# EAGLE design AtmegaSwitch (EAGLE 7.2.0)
CNAME: Final Year Project; CREVISION: 1.1; DESIGNER: Adil Benabdallah
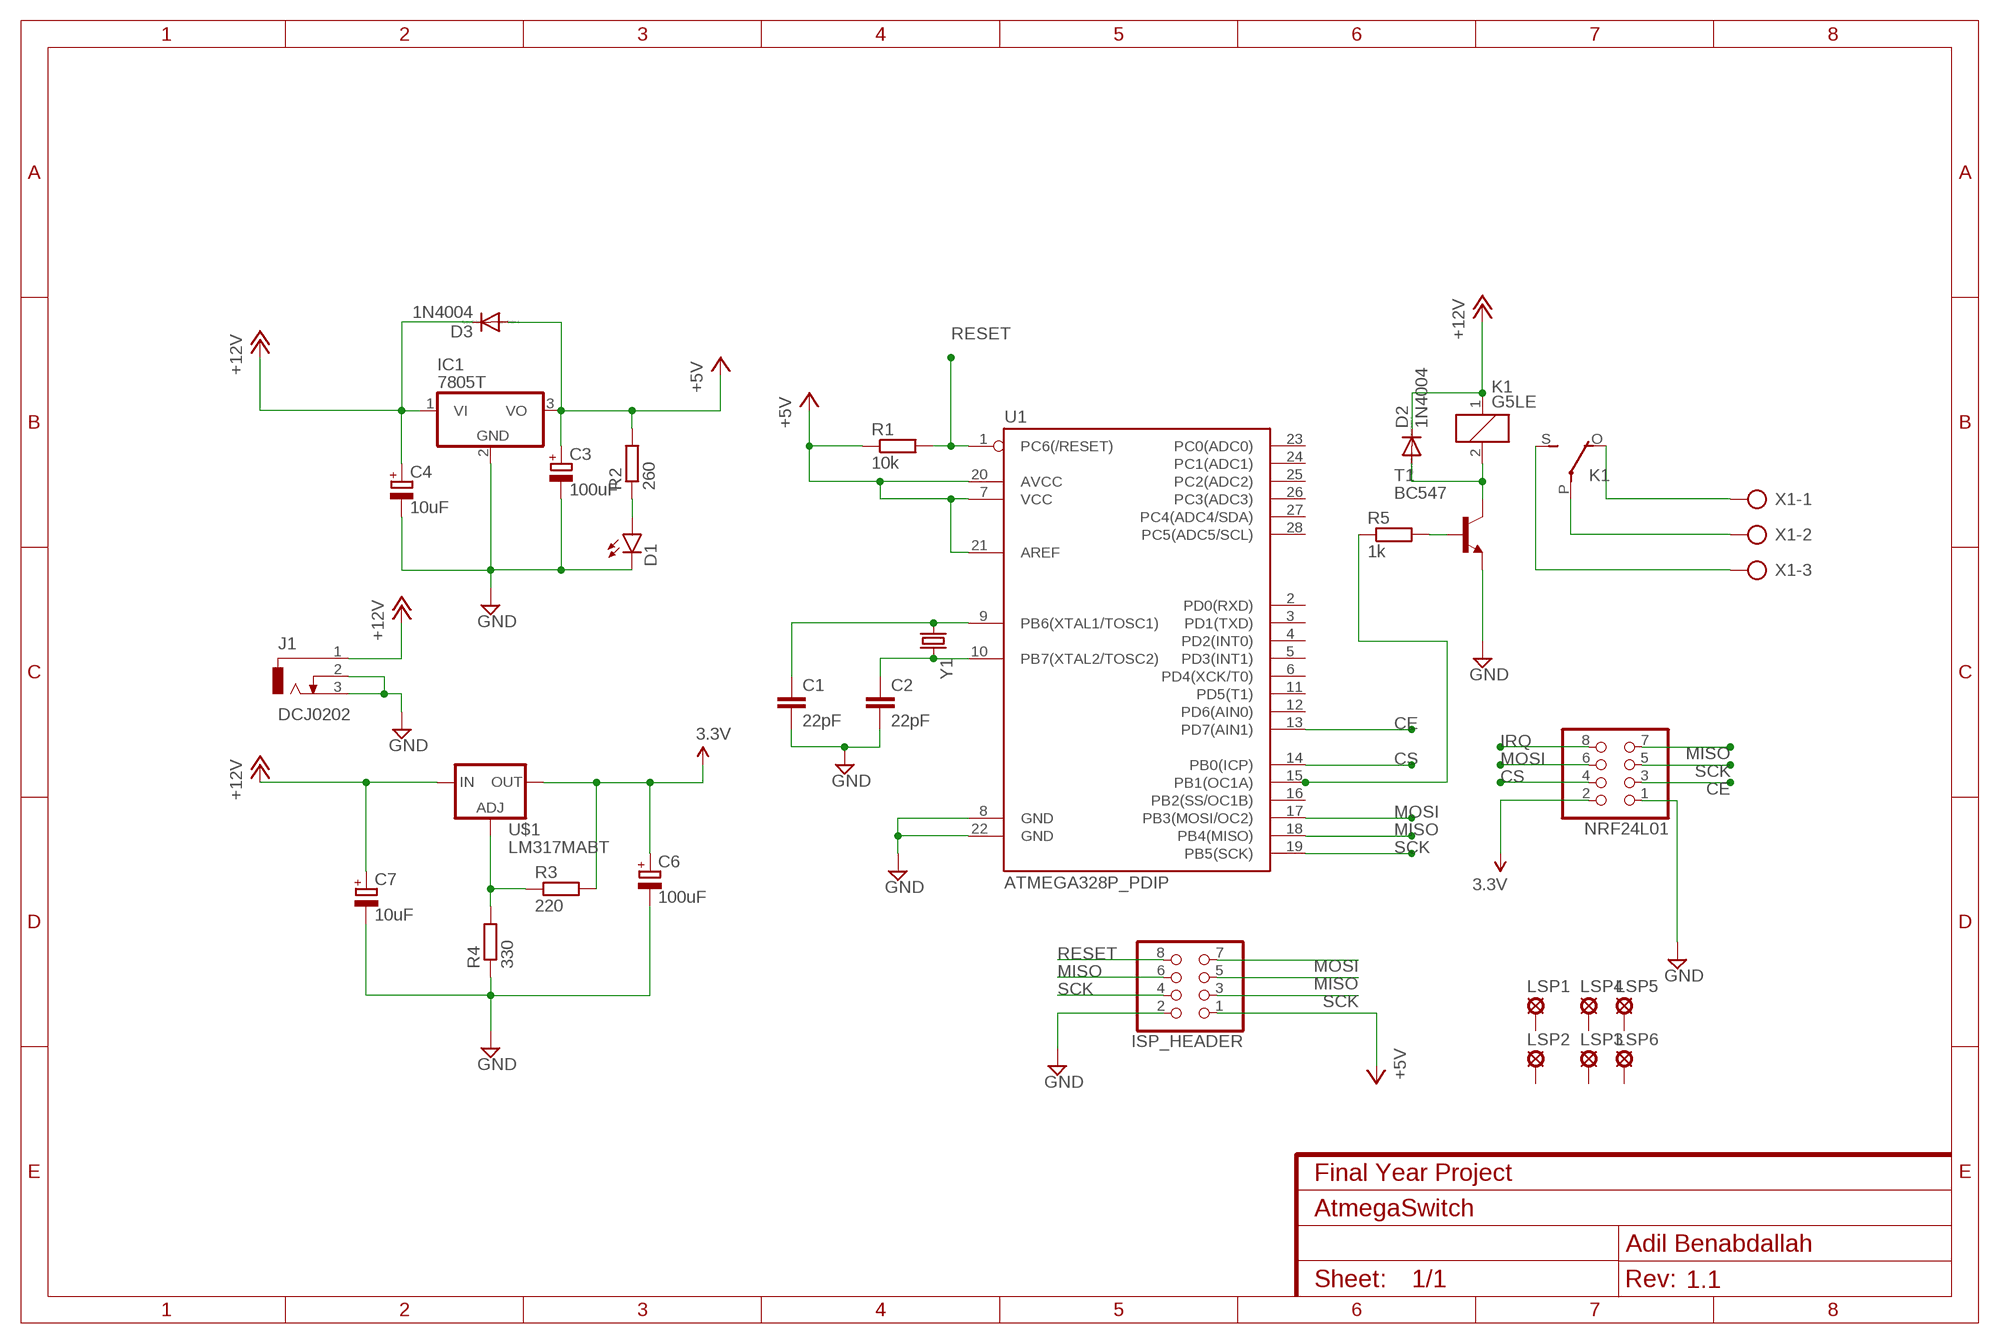
[diagram p0: schematic, sheet 1]

## Parts
C1  22pF  C-EU025-025X050  [C025-025X050]
C2  22pF  C-EU025-024X044  [C025-024X044]
C3  100uF  CPOL-EUE5-6  [E5-6]
C4  10uF  CPOL-EUE5-6  [E5-6]
C6  100uF  CPOL-EUE5-6  [E5-6]
C7  10uF  CPOL-EUE5-6  [E5-6]
D1  LED5MM  [LED5MM]
D2  1N4004  [DO41-10]
D3  1N4004  [DO41-10]
IC1  7805T  [TO220H]
ISP_HEADER  PINHD-2X4  [2X04]
J1  DCJ0202  [DCJ0202]
K1  G5LE  [G5LE]
LSP1  LSP10  [LSP10]
LSP2  LSP10  [LSP10]
LSP3  LSP10  [LSP10]
LSP4  LSP10  [LSP10]
LSP5  LSP10  [LSP10]
LSP6  LSP10  [LSP10]
NRF24L01  PINHD-2X4  [2X04]
R1  10k  R-EU_0204/7  [0204/7]
R2  260  R-EU_0204/7  [0204/7]
R3  220  R-EU_0204/7  [0204/7]
R4  330  R-EU_0204/7  [0204/7]
R5  1k  R-EU_0204/7  [0204/7]
T1  BC547  [TO92]
U1  ATMEGA328P_PDIP  [DIL28-3]
U$1  LM317MABT  [TO220L1]
X1  AK500/3-H  [AK500/3-H]
Y1  CRYSTALHC49US  [HC49US]

## Nets
3.3V: C6.+ NRF24L01.2 R3.2 U$1.2(OUT)
+5V: C3.+ D3.A IC1.3(VO) ISP_HEADER.1 R1.1 R2.2 U1.7(VCC) U1.20(AVCC) U1.21(AREF)
+12V: C4.+ C7.+ D2.C D3.C IC1.1(VI) J1.1 K1.1 U$1.3(IN)
CE: NRF24L01.3 U1.13(PD7(AIN1))
CS: NRF24L01.4 U1.14(PB0(ICP))
GND: C1.2 C2.2 C3.- C4.- C6.- C7.- D1.K(C) IC1.2(GND) ISP_HEADER.2 J1.2 J1.3 NRF24L01.1 R4.1 T1.1(E) U1.8(GND) U1.22(GND)
IRQ: NRF24L01.8
MISO: ISP_HEADER.5 ISP_HEADER.6 NRF24L01.7 U1.18(PB4(MISO))
MOSI: ISP_HEADER.7 NRF24L01.6 U1.17(PB3(MOSI/OC2))
N$1: C1.1 U1.9(PB6(XTAL1/TOSC1)) Y1.1
N$3: C2.1 U1.10(PB7(XTAL2/TOSC2)) Y1.2
N$4: D1.A R2.1
N$5: D2.A K1.2 T1.3(C)
N$6: K1.P(2:P) X1.2
N$7: K1.O(2:O) X1.1
N$8: K1.S(2:S) X1.3
N$9: R3.1 R4.2 U$1.1(ADJ)
N$10: R5.2 T1.2(B)
N$11: R5.1 U1.15(PB1(OC1A))
RESET: ISP_HEADER.8 R1.2 U1.1(PC6(/RESET))
SCK: ISP_HEADER.3 ISP_HEADER.4 NRF24L01.5 U1.19(PB5(SCK))
Unconnected: LSP1.MP LSP2.MP LSP3.MP LSP4.MP LSP5.MP LSP6.MP U1.2(PD0(RXD)) U1.3(PD1(TXD)) U1.4(PD2(INT0)) U1.5(PD3(INT1)) U1.6(PD4(XCK/T0)) U1.11(PD5(T1)) U1.12(PD6(AIN0)) U1.16(PB2(SS/OC1B)) U1.23(PC0(ADC0)) U1.24(PC1(ADC1)) U1.25(PC2(ADC2)) U1.26(PC3(ADC3)) U1.27(PC4(ADC4/SDA)) U1.28(PC5(ADC5/SCL))

## Library data of the parts
C1 = resistor:C-EU: CAPACITOR, European symbol
C2 = rcl:C-EU: CAPACITOR, European symbol
C3 C4 C6 C7 = rcl:CPOL-EU: POLARIZED CAPACITOR, European symbol
D1 = SparkFun-LED:LED: LEDs Standard schematic elements and footprints for 5mm, 3mm, 1206, and 0603 sized LEDs. 5mm - Spark Fun Electronics SKU : COM-00529 (and others)
D2 D3 = diode:1N4004: DIODE general purpose rectifier, 1 A
IC1 = linear:78*: Positive VOLTAGE REGULATOR Source: http://cache.national.com/ds/LM/LM78L05.pdf http://www.fairchildsemi.com/ds/LM/LM7805.pdf
ISP_HEADER NRF24L01 = pinhead:PINHD-2X4: PIN HEADER
J1 = con-jack:DCJ0202: DC POWER JACK Source: DCJ0202.pdf; OC_FARNELL: unknown; OC_NEWARK: unknown
K1 = relay:G5LE: RELAY 1 x switch, 10 A/120 V AC, 8 A/30 V DC, Omron; OC_FARNELL: unknown; OC_NEWARK: unknown
LSP1-LSP6 = solpad:LSP10: SOLDER PAD drill 1.0 mm, distributor Buerklin, 12H555
R1-R5 = rcl:R-EU_: RESISTOR, European symbol
T1 = transistor:BC547: NPN TRANSISTOR
U1 = SparkFun-DigitalIC:ATMEGA328P_PDIP: uC used in the Arduino 32kb flash, 1k EEPROM, 2k SRAM This is the through-hole version of this chip.
U$1 = v-reg:LM317?*: 500 mA Adjustable Output Positive Voltage Regulator Source: http://www.onsemi.co.jp .. LM317M-D.PDF
X1 = con-ptr500:AK500/3-H: CONNECTOR Aug. 2004 / PTR Meßtechnik: Die Bezeichnung der Serie AK505 wurde geändert. Es handelt sich hierbei um AK500 in horizontaler Ausführung.; OC_FARNELL: unknown; OC_NEWARK: unknown
Y1 = SparkFun-FreqCtrl:CRYSTAL: Various standard crystals. Proven footprints.

## Board
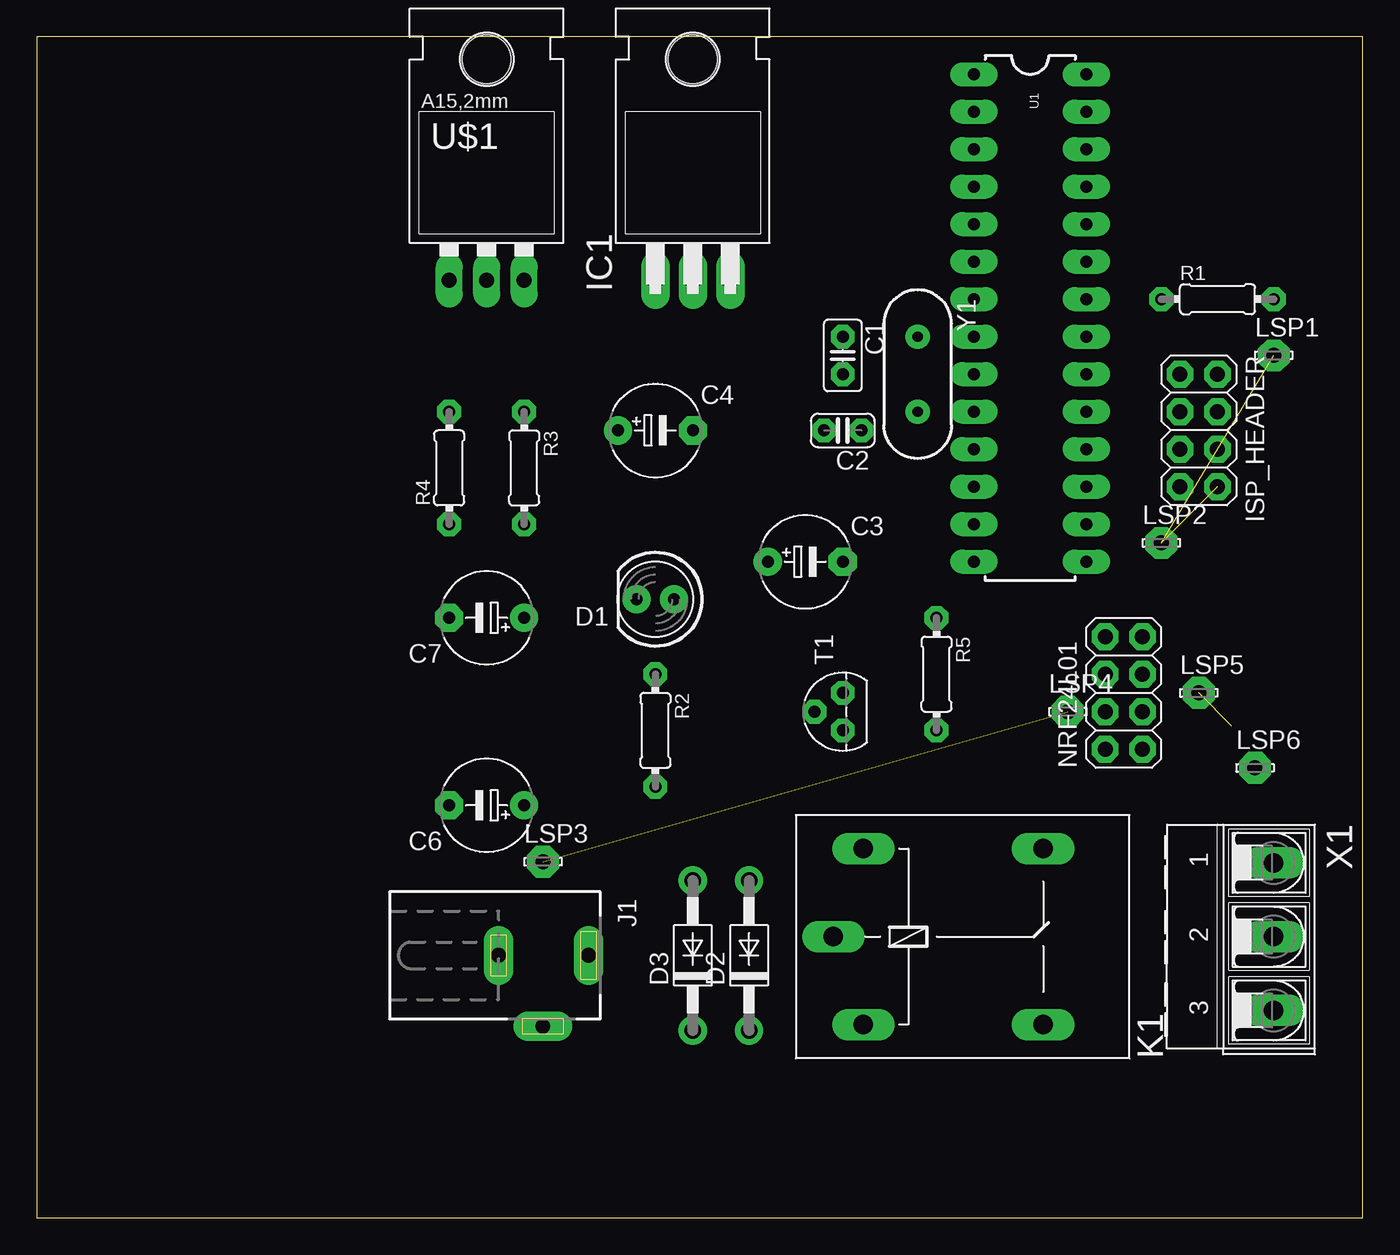
[diagram p1: board, top side]
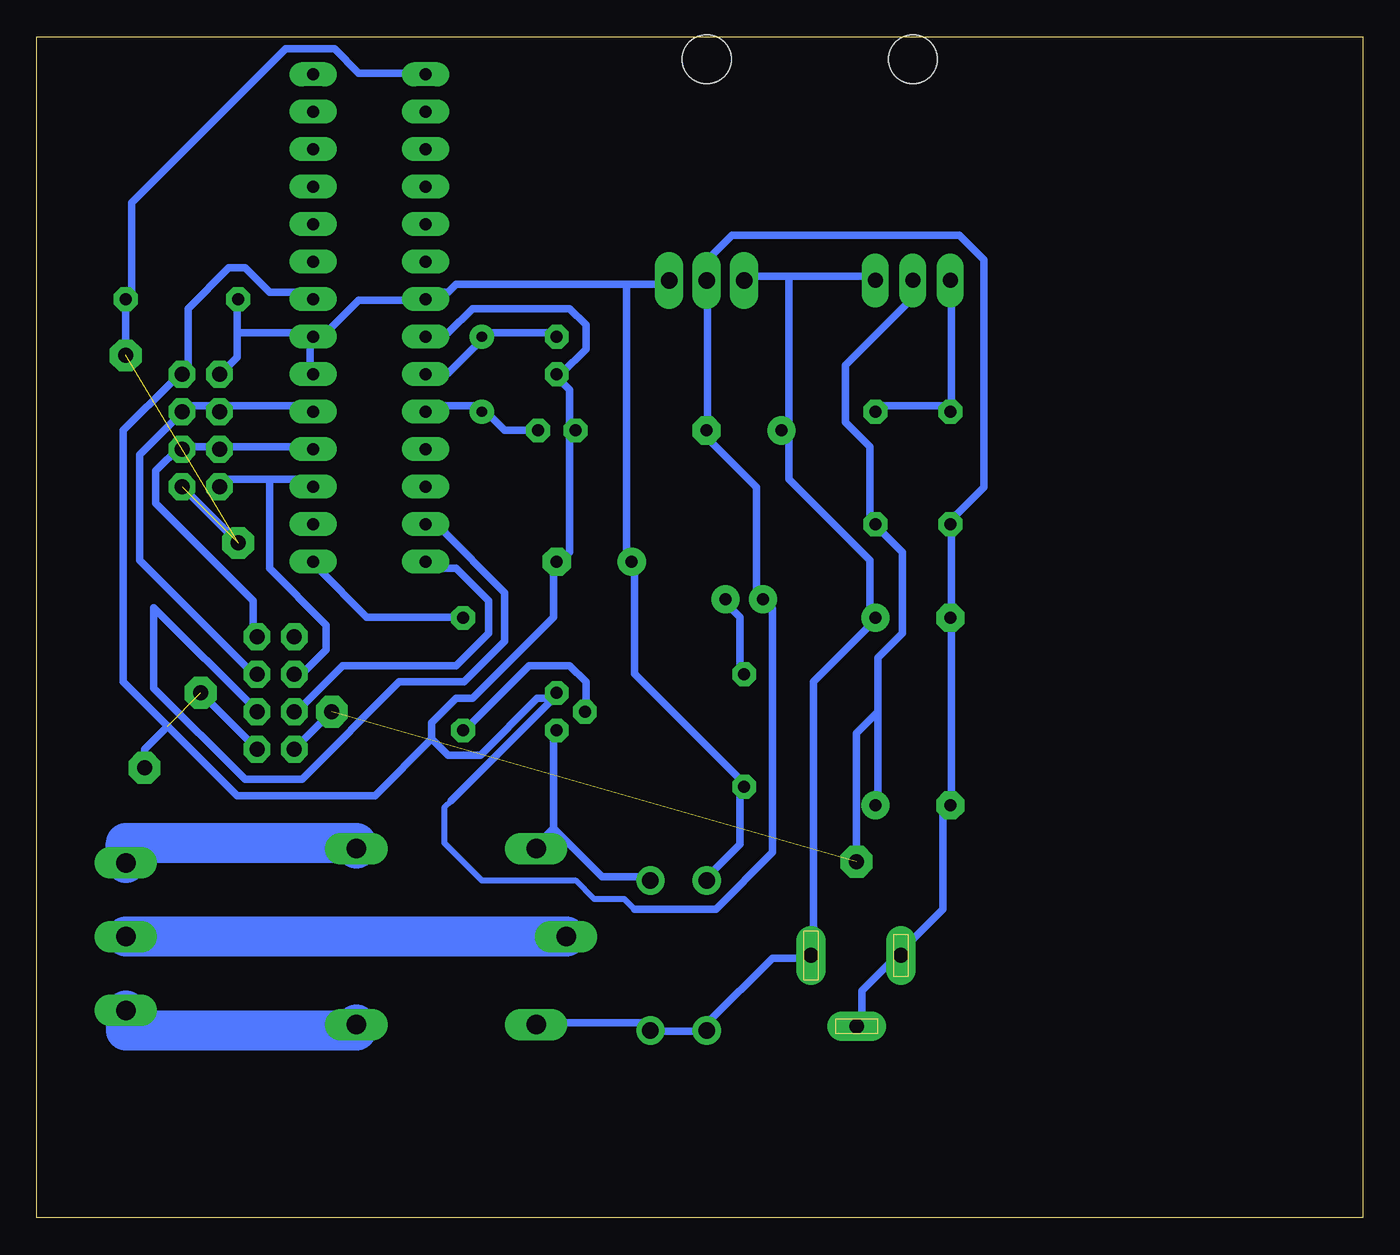
[diagram p2: board, bottom side, seen from below]

Size 89.84 x 80 mm. Coordinates in mm from the lower left corner, seen from the top.
Outline: 0,0 89.84,0 89.84,80 0,80 0,0
Copper layers (1*16): Top 0.035mm / dielectric 1.5mm / Bottom 0.035mm
Design rules "default *": minimum track width 0.5mm, minimum drill 10mil, track to track 0.6mm, track to pad 0.6mm, pad to pad 0.45mm, via to via 0.5mm, smd to smd 8mil, copper to edge 0.4mm, drill to drill 8mil, minimum pad ring 0.4mm, minimum via ring 8mil, stop-mask expansion 4mil, vias tented up to drill 0mil, thermal gap 10mil

### Footprints (pad centres in the part's own frame; a part is rotated, then mirrored left to right if it is on the bottom)
C025-025X050 = drill 0.813 octagon: 1 -1.27,0; 2 1.27,0
C025-024X044 = drill 0.813 octagon: 1 -1.27,0; 2 1.27,0
E5-6 = drill 0.813 pad 1.905: + -2.54,0 | drill 0.813 pad 1.905 octagon: - 2.54,0
LED5MM = drill 0.813 pad 1.88: A -1.27,0; K 1.27,0
DO41-10 = drill 1.118: A 5.08,0; C -5.08,0
TO220H = drill 1.118 long: 1 -2.54,-10.16; 2 0,-10.16; 3 2.54,-10.16 | hole 3.302: 0,4.826
2X04 = drill 1.016 octagon: 1 -3.81,-1.27; 2 -3.81,1.27; 3 -1.27,-1.27; 4 -1.27,1.27; 5 1.27,-1.27; 6 1.27,1.27; 7 3.81,-1.27; 8 3.81,1.27
DCJ0202 = drill 1 pad 2 long: 1 0,3.1; 2 4.8,0; 3 0,-3
G5LE = drill 1.321 long: 1 -7.493,-5.969; 2 -7.493,5.969; O 4.699,5.969; P -9.525,0; S 4.699,-5.969
LSP10 = drill 1.016 pad 2.159 octagon: MP 0,0
0204/7 = drill 0.813 octagon: 1 -3.81,0; 2 3.81,0
TO92 = drill 0.813 octagon: 1 1.27,0; 2 0,1.905; 3 -1.27,0
DIL28-3 = drill 0.813 long: 1 -16.51,-3.81; 2 -13.97,-3.81; 3 -11.43,-3.81; 4 -8.89,-3.81; 5 -6.35,-3.81; 6 -3.81,-3.81; 7 -1.27,-3.81; 8 1.27,-3.81; 9 3.81,-3.81; 10 6.35,-3.81; 11 8.89,-3.81; 12 11.43,-3.81; 13 13.97,-3.81; 14 16.51,-3.81; 15 16.51,3.81; 16 13.97,3.81; 17 11.43,3.81; 18 8.89,3.81; 19 6.35,3.81; 20 3.81,3.81; 21 1.27,3.81; 22 -1.27,3.81; 23 -3.81,3.81; 24 -6.35,3.81; 25 -8.89,3.81; 26 -11.43,3.81; 27 -13.97,3.81; 28 -16.51,3.81
TO220L1 = drill 1.016 long: 1 -2.54,-3.81; 2 0,-3.81; 3 2.54,-3.81 | hole 3.302: 0,11.176
AK500/3-H = drill 1.321 long: 1 -5.004,0; 2 0,0; 3 5.004,0
HC49US = drill 0.7 pad 1.651: 1 -2.54,0; 2 2.54,0

### Placement (x,y rotation side)
C1  54.61,58.42 270 top
C2  54.61,53.34 180 top
C3  52.07,44.45 0 top
C4  41.91,53.34 0 top
C6  30.48,27.94 180 top
C7  30.48,40.64 180 top
D1  41.91,41.91 180 top
D2  48.26,17.78 90 top
D3  44.45,17.78 90 top
IC1  44.45,73.66 0 top
ISP_HEADER  78.74,53.34 270 top
J1  34.29,17.78 270 top
K1  63.5,19.05 0 top
LSP1  83.82,58.42 0 top
LSP2  76.2,45.72 0 top
LSP3  34.29,24.13 0 top
LSP4  69.85,34.29 0 top
LSP5  78.74,35.56 0 top
LSP6  82.55,30.48 0 top
NRF24L01  73.66,35.56 90 top
R1  80.01,62.23 0 top
R2  41.91,33.02 270 top
R3  33.02,50.8 270 top
R4  27.94,50.8 90 top
R5  60.96,36.83 270 top
T1  54.61,34.29 90 top
U1  67.31,60.96 270 top
U$1  30.48,67.31 0 top
X1  83.82,19.05 270 top
Y1  59.69,57.15 270 top

### Tracks (layer width: path | path; a pad name or v marks a point on that pad's centre or on a via)
3.3V  (1 unrouted)
  Bottom 0.5: U$1.2 30.63,63.25 30.63,62.15 35.03,57.75 35.03,53.9 33.38,52.25 33.38,47.3 R3.2 32.83,46.75 31.18,45.1 31.18,39.6 32.83,37.95 32.83,34.29 | 32.83,34.29 32.83,28.05 C6.+ | NRF24L01.2 69.85,34.29 | 32.83,34.29 34.29,32.83 34.29,24.13
+5V
  Bottom 0.5: D3.A 44.38,23.1 42.18,25.3 42.18,29.15 R2.2 42.18,29.7 49.33,36.85 49.33,44 C3.+ 49.88,44.55 49.88,63.25 | 76.28,59.95 76.28,58.3 77.38,57.2 ISP_HEADER.1 | 76.28,59.95 76.28,62.15 R1.1 | U1.20 71.33,57.2 71.33,59.4 U1.21 | U1.21 70.78,59.4 68.03,62.15 63.63,62.15 U1.7 63.08,62.7 61.98,62.7 61.43,63.25 49.88,63.25 | 49.88,63.25 47.13,63.25 IC1.3 | 76.28,59.95 71.33,59.95 U1.21
+12V
  Bottom 0.5: K1.1 55.93,13.2 48.78,13.2 D2.C 48.23,12.65 44.93,12.65 D3.C 44.38,13.2 39.98,17.6 37.78,17.6 J1.1 37.23,18.15 37.23,36.3 33.38,40.15 C7.+ 33.38,40.7 33.38,44.55 38.88,50.05 38.88,52.8 C4.+ 38.88,53.35 38.88,63.8 | 38.88,63.8 41.63,63.8 IC1.1 | 38.88,63.8 33.38,63.8 U$1.3
CE
  Bottom 0.5: U1.13 63.08,46.75 62.53,46.75 58.13,42.35 58.13,39.05 60.88,36.3 65.28,36.3 71.88,29.7 75.73,29.7 81.91,35.88 81.91,41.34 74.93,34.36 NRF24L01.3 75.18,34.1
CS
  Bottom 0.5: U1.14 63.08,44 61.43,44 59.23,41.8 59.23,39.6 61.43,37.4 69.13,37.4 71.88,34.65 NRF24L01.4
GND  (1 unrouted)
  Bottom 0.406: 49.33,20.9 50.02,21.59 52.07,21.59 53.34,22.86 59.69,22.86 62.23,25.4 62.23,27.8 61.77,28.26
  Bottom 0.5: U1.8 63.08,59.95 61.98,59.95 60.33,61.6 53.73,61.6 52.63,60.5 52.63,58.85 54.28,57.2 C1.2 54.28,56.65 53.73,56.1 53.73,53.35 C2.2 53.73,52.8 53.73,45.1 54.28,44.55 C3.- 54.83,44 54.83,40.7 60.33,35.2 61.43,35.2 63.08,33.55 63.08,32.45 | U1.22 71.33,62.7 74.08,62.7 75.73,64.35 76.83,64.35 79.58,61.6 79.58,57.2 ISP_HEADER.2 80.13,56.65 80.68,56.65 83.98,53.35 83.98,36.3 80.99,33.31 | 54.83,35.2 55.93,35.2 59.78,31.35 61.98,31.35 63.08,32.45 | 80.99,33.31 76.28,28.6 66.93,28.6 63.08,32.45 | J1.2 33.93,13.2 33.93,15.4 31.73,17.6 J1.3 31.18,18.15 28.43,20.9 28.43,27.5 C6.- 27.88,28.05 27.88,40.15 C7.- 27.88,40.7 27.88,46.75 R4.1 27.88,47.3 25.68,49.5 25.68,64.9 27.33,66.55 42.73,66.55 44.38,64.9 44.38,63.8 IC1.2 44.38,63.25 44.38,53.35 C4.- 44.38,52.8 41.08,49.5 41.08,42.35 D1.K 39.98,41.25 39.98,24.75 43.83,20.9 49.33,20.9 | 61.77,28.26 54.83,35.2 | 54.83,35.2 T1.1 | NRF24L01.1 78.74,35.56 | 80.99,33.31 82.55,31.75 82.55,30.48
MISO
  Bottom 0.5: U1.18 71.33,52.25 77.38,52.25 ISP_HEADER.5 77.93,52.25 79.58,52.25 ISP_HEADER.6 80.13,52.25 81.78,50.6 81.78,48.4 75.18,41.8 75.18,39.6 NRF24L01.7
MOSI
  Bottom 0.5: 74.08,50.05 77.38,50.05 ISP_HEADER.7 | 74.08,50.05 71.33,50.05 U1.17 | 74.08,50.05 74.08,44 70.23,40.15 70.23,38.5 71.88,36.85 NRF24L01.6
N$1
  Bottom 0.5: U1.9 63.08,57.2 61.98,57.2 59.78,59.4 Y1.1 59.23,59.95 54.83,59.95 C1.1
N$3
  Bottom 0.5: C2.1 55.93,53.35 58.13,53.35 59.23,54.45 Y1.2 59.78,55 63.08,55 U1.10
N$4
  Bottom 0.5: R2.1 42.18,36.85 42.18,40.7 43.28,41.8 D1.A
N$5
  Bottom 0.5: 54.83,26.4 54.83,33 T1.3 | 54.83,26.4 55.93,25.3 K1.2 | 54.83,26.4 51.53,23.1 48.78,23.1 D2.A
N$6
  Bottom 2.7: K1.P X1.2
N$7
  Bottom 2.7: X1.1 83.82,25.4 68.2,25.4 K1.O
N$8
  Bottom 2.7: X1.3 83.82,12.7 68.2,12.7 K1.S
N$9
  Bottom 0.5: R3.1 32.83,55 28.43,55 R4.2 27.88,55 27.88,63.25 U$1.1
N$10
  Bottom 0.5: T1.2 52.63,34.65 52.63,36.3 53.73,37.4 56.48,37.4 60.88,33 R5.2
N$11
  Bottom 0.5: R5.1 61.43,40.7 67.48,40.7 70.78,44 U1.15
RESET  (2 unrouted)
  Bottom 0.5: U1.1 63.63,77.55 68.03,77.55 69.68,79.2 72.98,79.2 83.43,68.75 83.43,62.7 R1.2 83.82,58.42 | ISP_HEADER.8 76.2,45.72
SCK
  Bottom 0.5: U1.19 71.33,55 77.38,55 ISP_HEADER.3 77.93,55 79.58,55 ISP_HEADER.4 80.13,54.45 82.88,51.7 82.88,44.55 75.18,36.85 NRF24L01.5